# EAGLE design jlink-swd (EAGLE 8.7.1)
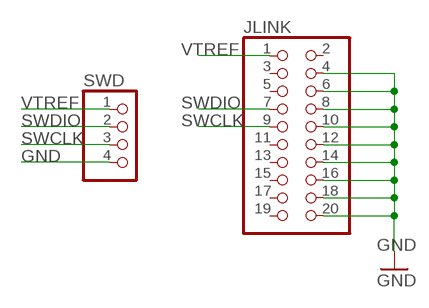
[diagram p0: schematic, sheet 1]

## Parts
JLINK  PINHD-2X10  [2X10]
SWD  PINHD-1X4  [1X04]

## Nets
GND: JLINK.4 JLINK.6 JLINK.8 JLINK.10 JLINK.12 JLINK.14 JLINK.16 JLINK.18 JLINK.20 SWD.4
SWCLK: JLINK.9 SWD.3
SWDIO: JLINK.7 SWD.2
VTREF: JLINK.1 SWD.1
Unconnected: JLINK.2 JLINK.3 JLINK.5 JLINK.11 JLINK.13 JLINK.15 JLINK.17 JLINK.19

## Library data of the parts
JLINK = pinhead:PINHD-2X10: PIN HEADER
SWD = pinhead:PINHD-1X4: PIN HEADER

## Board
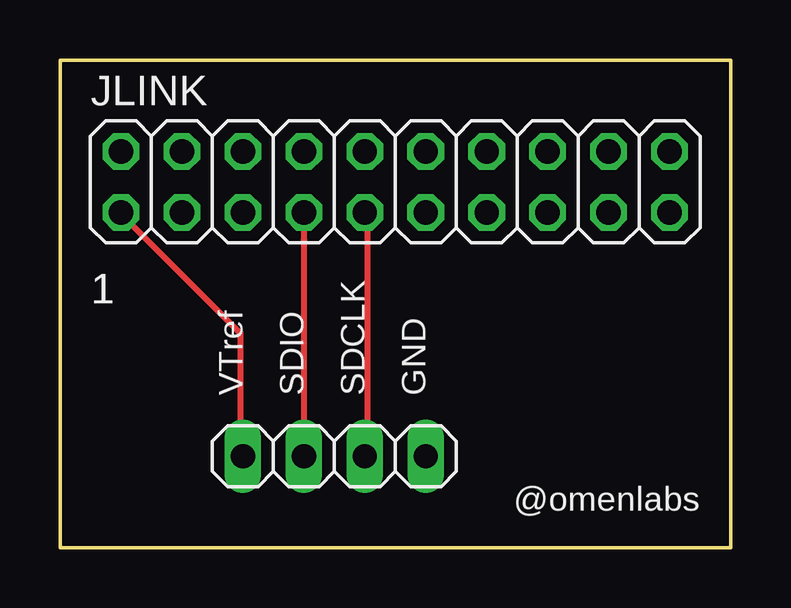
[diagram p1: board, top side]
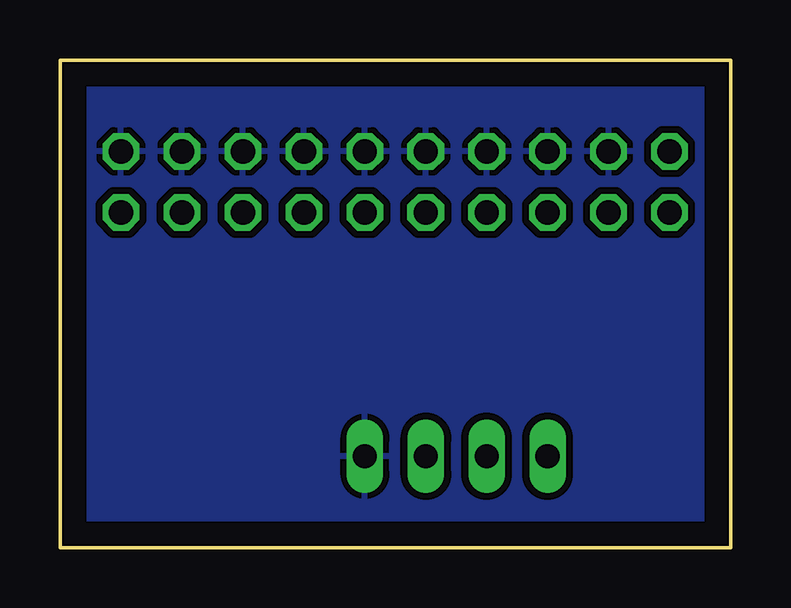
[diagram p2: board, bottom side, seen from below]

Size 27.94 x 20.32 mm. Coordinates in mm from the lower left corner, seen from the top.
Outline: 0,0 0,20.32 27.94,20.32 27.94,0 0,0
Copper layers (1*16): Top 0.035mm / dielectric 1.5mm / Bottom 0.035mm
Design rules "oshpark-2layer": minimum track width 6mil, minimum drill 0.35mm, track to track 6mil, track to pad 6mil, pad to pad 6mil, via to via 6mil, smd to smd 6mil, copper to edge 40mil, drill to drill 6mil, minimum pad ring 10mil, minimum via ring 8mil, stop-mask expansion 4mil, vias tented up to drill 0mil, thermal gap 10mil

### Footprints (pad centres in the part's own frame; a part is rotated, then mirrored left to right if it is on the bottom)
2X10 = drill 1.016 octagon: 1 -11.43,-1.27; 2 -11.43,1.27; 3 -8.89,-1.27; 4 -8.89,1.27; 5 -6.35,-1.27; 6 -6.35,1.27; 7 -3.81,-1.27; 8 -3.81,1.27; 9 -1.27,-1.27; 10 -1.27,1.27; 11 1.27,-1.27; 12 1.27,1.27; 13 3.81,-1.27; 14 3.81,1.27; 15 6.35,-1.27; 16 6.35,1.27; 17 8.89,-1.27; 18 8.89,1.27; 19 11.43,-1.27; 20 11.43,1.27
1X04 = drill 1.016 long: 1 -3.81,0; 2 -1.27,0; 3 1.27,0; 4 3.81,0

### Placement (x,y rotation side)
JLINK  13.97,15.24 0 top
SWD  11.43,3.81 0 top

### Tracks (layer width: path | path; a pad name or v marks a point on that pad's centre or on a via)
GND
  pour Bottom (isolate 0.305): 0,0 0,20.32 27.94,20.32 27.94,0
SWCLK
  Top 0.152: 12.8,3.81 SWD.3 | 12.8,13.87 JLINK.9
  Top 0.254: SWD.3 12.8,3.86 12.8,13.82 JLINK.9
  Bottom 0.152: 12.8,3.81 SWD.3 | 12.8,13.87 JLINK.9
SWDIO
  Top 0.152: 10.21,3.81 SWD.2 | 10.21,13.87 JLINK.7
  Top 0.254: JLINK.7 SWD.2
  Bottom 0.152: 10.21,3.81 SWD.2 | 10.21,13.87 JLINK.7
VTREF
  Top 0.152: 2.59,13.87 JLINK.1
  Top 0.254: SWD.1 7.52,3.86 7.52,8.94 2.64,13.82 JLINK.1
  Bottom 0.152: 2.59,13.87 JLINK.1

### Text on the board
tPlace: 1 | VTref | SDIO | SDCLK | GND | @omenlabs